# EAGLE design E-P-204-R3 (EAGLE 7.7.0)
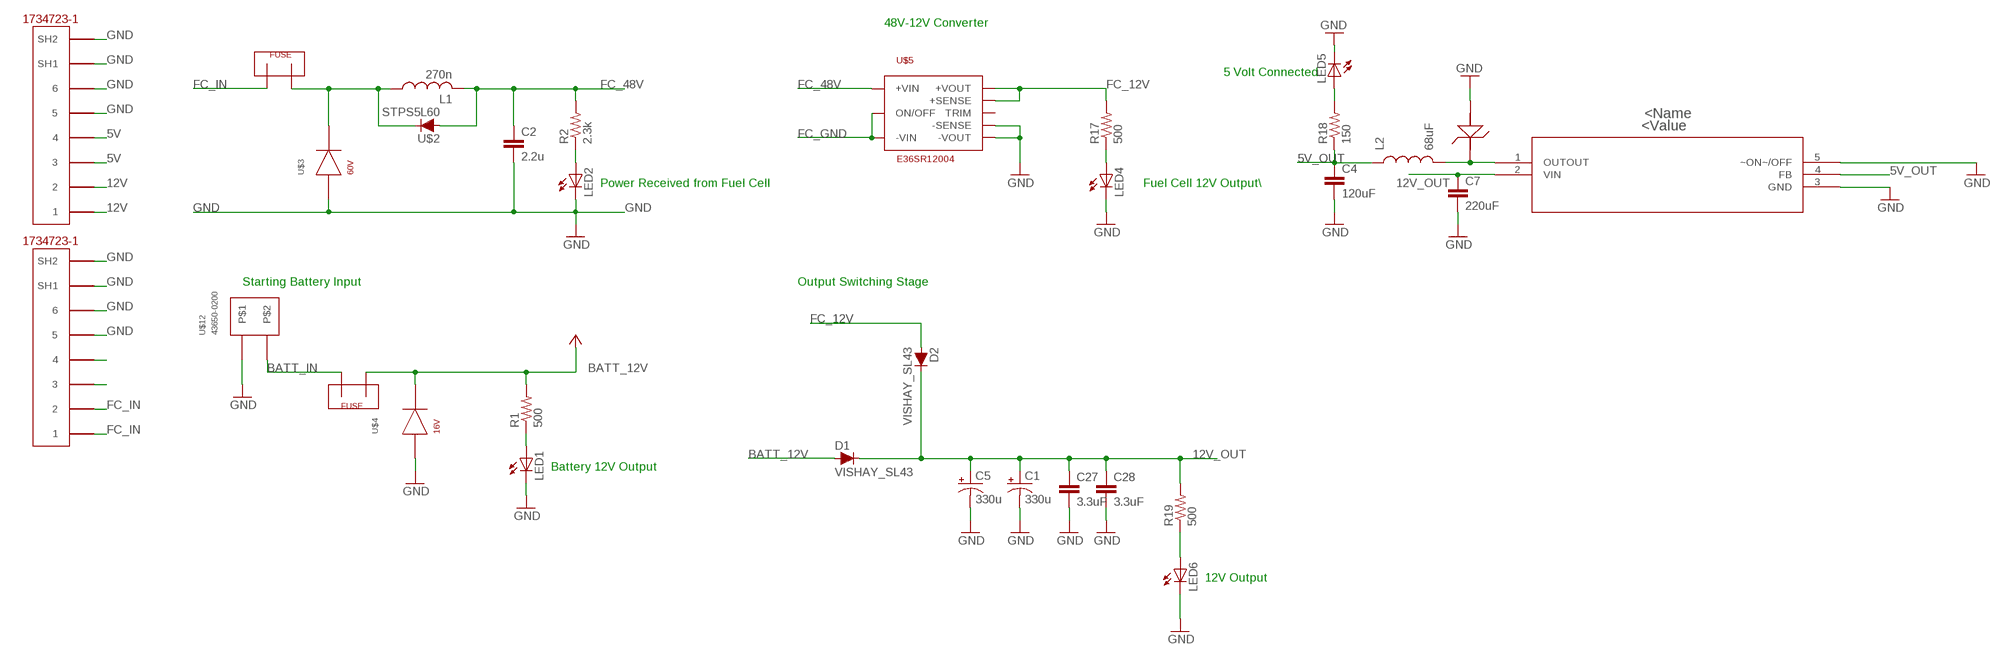
[diagram p0: schematic, sheet 1]

## Parts
C1  330u  CAP_POLE  [PANASONIC_E]
C2  2.2u  C-EUC1210  [C1210]
C4  120uF  CAP0805  [0805]
C5  330u  CAP_POLE  [PANASONIC_E]
C7  220uF  CAP0805  [0805]
C27  3.3uF  C-EUC0805K  [C0805K]
C28  3.3uF  C-EUC0805K  [C0805K]
D1  VISHAY_SL43  [DO-214AB_SMC]
D2  VISHAY_SL43  [DO-214AB_SMC]
L1  270n  L-USL3225P  [L3225P]
L2  68uF  INDUCTOR0805  [0805]
LED1  LED1206  [LED-1206]
LED2  LED1206  [LED-1206]
LED4  LED1206  [LED-1206]
LED5  LED1206  [LED-1206]
LED6  LED1206  [LED-1206]
R1  500  R-US_M0805  [M0805]
R2  2.3k  R-US_M0805  [M0805]
R17  500  R-US_M0805  [M0805]
R18  150  R-US_M0805  [M0805]
R19  500  R-US_M0805  [M0805]
U$2  STPS5L60  [STM_SMC]
U$3  SMBJ60CA  [.277X.089]
U$4  SMAJ16CA  [.25X.07]
U$5  E36SR12004  [2.30X0.90X0.34]
U$6  5555140-6  [1734723-1_RJ11]
U$7  FUSEMINI-BLADE  [MINI-BLADE-FUSE]
U$8  LM2595T-5.0  [T05D]
U$9  MURS120T3G  [MURS120T3G]
U$10  FUSEMINI-BLADE  [MINI-BLADE-FUSE]
U$11  5555140-6  [1734723-1_RJ11]
U$12  43650-0200  [43650-0200]

## Nets
5V: U$11.3 U$11.4
5V_OUT: C4.1 L2.1 R18.1 U$8.4(FB)
12V: U$11.1 U$11.2
12V_OUT: C1.+ C5.+ C7.1 C27.1 C28.1 D1.C D2.C R19.2 U$8.2(VIN)
BATT_12V: D1.A R1.2 U$4.CATHODE U$10.OUT ; supply symbol labelled +5V
BATT_IN: U$10.IN U$12.P$1
FC_12V: D2.A R17.2 U$5.P$7(+SENSE) U$5.P$8(+VOUT)
FC_48V: C2.1 L1.2 R2.2 U$2.A U$5.P$1(+VIN)
FC_FUSED: L1.1 U$2.C U$3.CATHODE U$7.IN
FC_GND: U$5.P$2(ON/OFF) U$5.P$3(-VIN)
FC_IN: U$6.1 U$6.2 U$7.OUT
GND: C1.- C2.2 C4.2 C5.- C7.2 C27.2 C28.2 LED1.C LED2.C LED4.C LED5.C LED6.C U$3.ANODE U$4.ANODE U$5.P$4(-VOUT) U$5.P$5(-SENSE) U$6.5 U$6.6 U$6.SH1 U$6.SH2 U$8.3(GND) U$8.5(~ON~/OFF) U$9.P$2(PIN1) U$11.5 U$11.6 U$11.SH1 U$11.SH2 U$12.P$2
N$3: LED1.A R1.1
N$4: LED2.A R2.1
N$16: L2.2 U$8.1(OUTOUT) U$9.P$1
N$17: LED5.A R18.2
N$20: U$6.4
N$21: LED4.A R17.1
N$23: U$6.3
N$24: LED6.A R19.1
Unconnected: U$5.P$6(TRIM)

## Notes on the sheet
- 48V-12V Converter
- 5 Volt Connected
- Power Received from Fuel Cell | Fuel Cell 12V Output\
- Starting Battery Input | Output Switching Stage
- Battery 12V Output
- 12V Output

## Library data of the parts
C1 C5 = SparkFun-Capacitors:CAP_POL: Capacitor Polarized These are standard SMD and PTH capacitors. Normally 10uF, 47uF, and 100uF in electrolytic and tantalum varieties. Always verify the external diameter of the through hole cap, it varies with capacity, voltage, and manufacturer. The EIA devices should be standard.
C2 C27 C28 = resistor:C-EU: CAPACITOR, European symbol
C4 C7 = SparkFun-Passives:CAP: Capacitor Standard 0603 ceramic capacitor, and 0.1" leaded capacitor.
D1 D2 = Power Board Components:VISHAY_SL43
L1 = resistor:L-US: INDUCTOR, American symbol
L2 = SparkFun-Passives:INDUCTOR: Inductors Basic Inductor/Choke - 0603 and 1206. Footprints are not proven and vary greatly between part numbers. INDUCTOR POWER 3.3UH 4.0A SMD 0.197" L x 0.197" W x 0.177" H (5.00mm x 5.00mm x 4.50mm)
LED1 LED2 LED4-LED6 = SparkFun:LED: LEDs Standard schematic elements and footprints for 5mm, 3mm, 1206, and 0603 sized LEDs. 5mm - Spark Fun Electronics SKU : COM-00529 (and others)
R1 R2 R17-R19 = rcl:R-US_: RESISTOR, American symbol
U$2 = Power Board Components:STPS5L60
U$3 = Power Board Components:SMBJ60CA
U$4 = Power Board Components:SMAJ16CA
U$5 = Power Board Components:E36SR12004
U$6 U$11 = 5555140-6 RJ11:5555140-6
U$7 U$10 = Shell2013:FUSE
U$8 = 5V Reg LM2595T-5.0:LM2595T-5.0; BASE_PN: LM259X; COMPTYPE: Switcher; COPYRIGHT: Copyright C 2015 Accelerated Designs. All rights reserved; MANUFACTURER_PART_NUMBER: LM2595T50; SYMBOL: NameLM2595T50; TYPE: LM2595T5.0; VENDOR: National Semiconductor; VERSION: 05022007
U$9 = MURS120T3G:MURS120T3G
U$12 = Shell2013:43650-0200

## Board
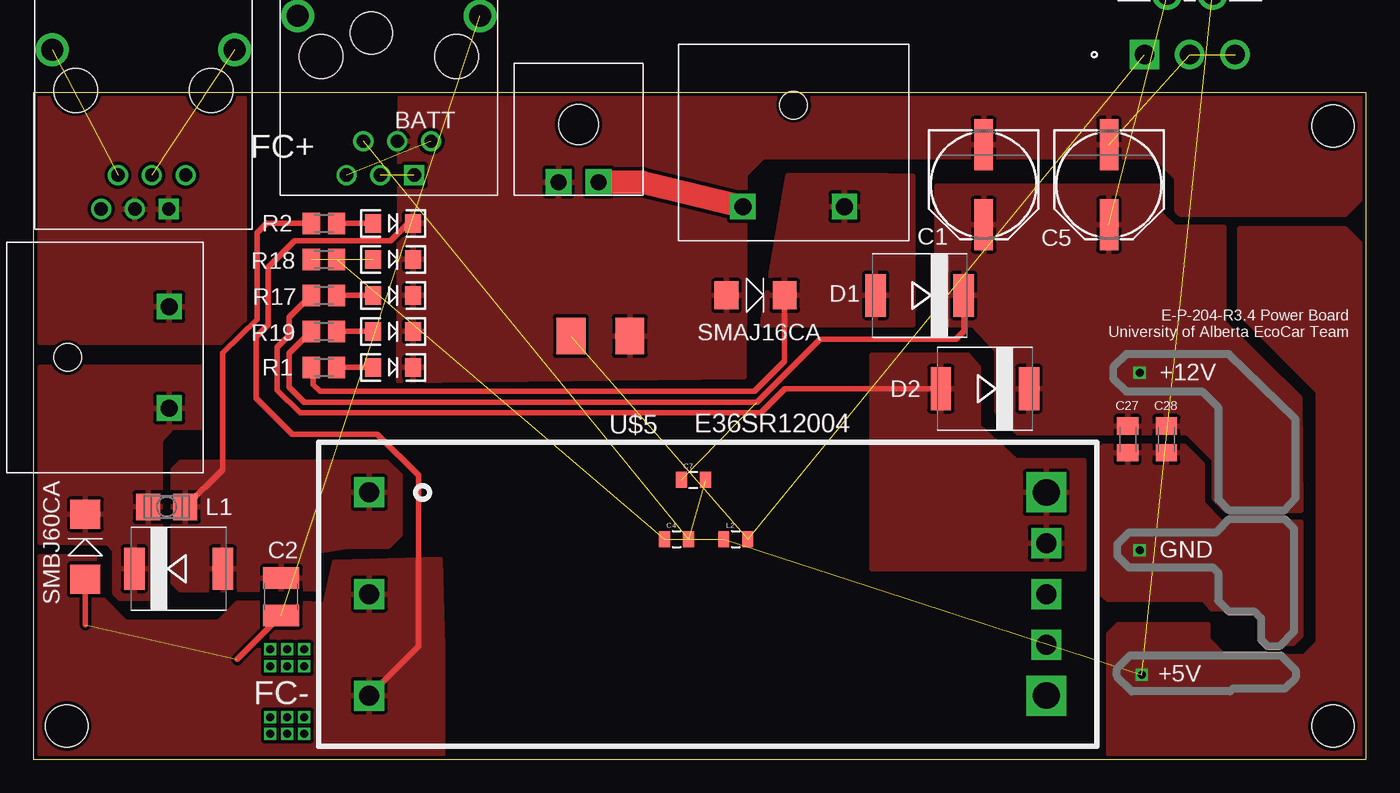
[diagram p1: board, top side]
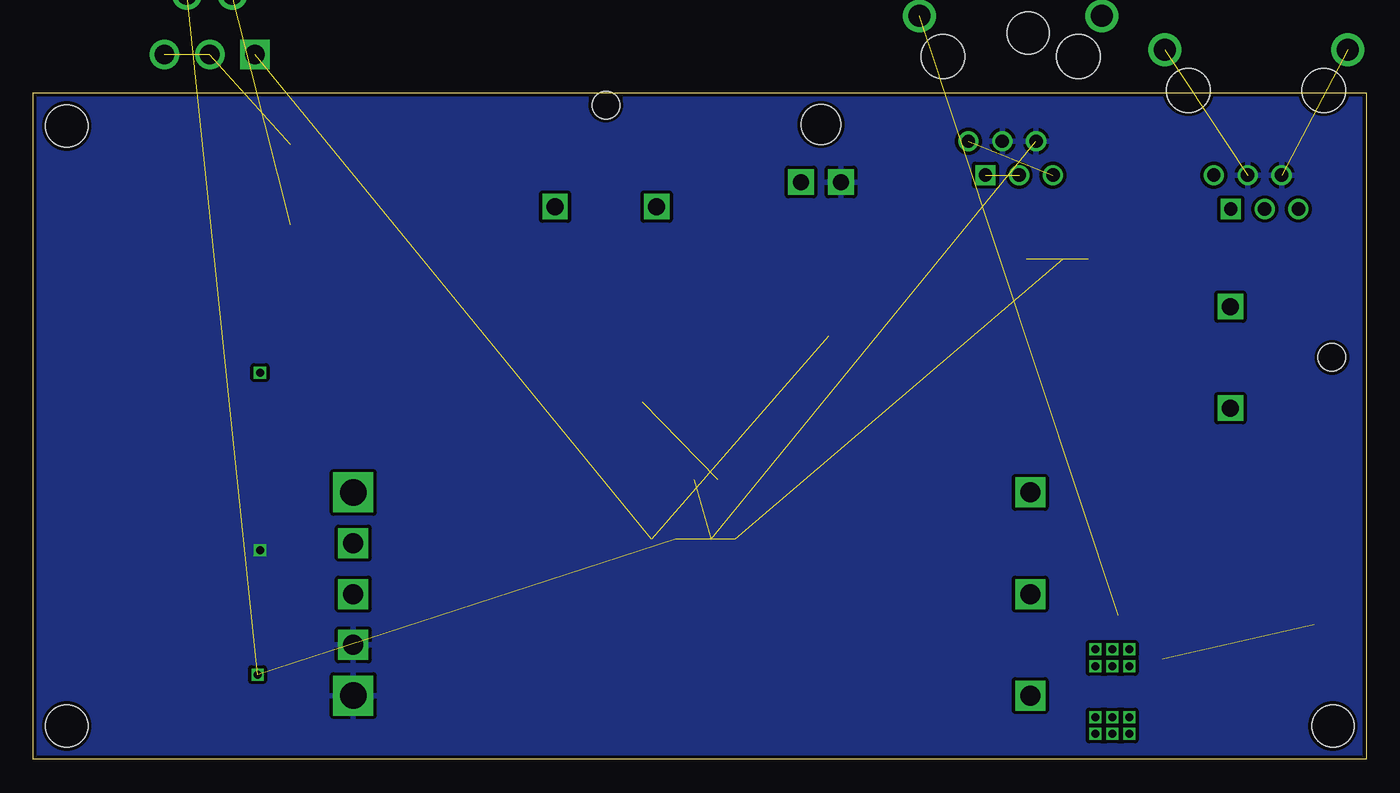
[diagram p2: board, bottom side, seen from below]

Size 100 x 50 mm. Coordinates in mm from the lower left corner, seen from the top.
Outline: 0,0 100,0 100,50 0,50 0,0
Copper layers (1*16): Top 0.035mm / dielectric 1.5mm / Bottom 0.035mm
Design rules "SeeedStudio_2layer_DRU_no_angle_20140221 *": minimum track width 10mil, minimum drill 12mil, track to track 10mil, track to pad 10mil, pad to pad 10mil, via to via 10mil, smd to smd 0mil, copper to edge 10mil, drill to drill 10mil, minimum pad ring 10mil, minimum via ring 6mil, stop-mask expansion 2mil, vias tented up to drill 100mil, thermal gap 10mil
Holes 3.17 mm at 97.5,47.5 2.5,2.5 97.5,2.5 25.36,54.48

### Footprints (pad centres in the part's own frame; a part is rotated, then mirrored left to right if it is on the bottom)
PANASONIC_E = smd 3.8 x 1.4: + 3,0; - -3,0
C1210 = smd 1.6 x 2.7: 1 -1.4,0; 2 1.4,0
0805 = smd 0.8 x 1.2: 1 -0.9,0; 2 0.9,0
C0805K = smd 1.3 x 1.6: 1 -1,0; 2 1,0
DO-214AB_SMC = smd 1.524 x 3.2: A 3.302,0; C -3.302,0
L3225P = smd 1.8 x 2: 1 -1.4,0; 2 1.4,0
LED-1206 = smd 1.2 x 1.4: A -1.5,0; C 1.5,0
M0805 = smd 1.3 x 1.6: 1 -0.95,0; 2 0.95,0
STM_SMC = smd 1.54 x 3.14: A 3.325,0; C -3.325,0
.277X.089 = smd 2.159 x 2.261: ANODE 0,0; CATHODE 4.877,0
.25X.07 = smd 1.778 x 2.083: ANODE 0,0; CATHODE 4.369,0
2.30X0.90X0.34 = drill 1.5 square: P$1 -25.4,7.62; P$2 -25.4,0; P$3 -25.4,-7.62; P$5 25.4,-3.81; P$6 25.4,0; P$7 25.4,3.81 | drill 2 square: P$4 25.4,-7.62; P$8 25.4,7.62
1734723-1_RJ11 = drill 1 square: 1 -2.54,2.54 | drill 1: 2 0,2.54; 3 2.54,2.54; 4 -3.81,0; 5 -1.27,0; 6 1.27,0 | drill 1.65: SH1 -7.5,-9.4; SH2 6.22,-9.4 | hole 3.3: -5.72,-6.35; 4.44,-6.35
MINI-BLADE-FUSE = drill 1.27 square: IN 3.81,7.62; OUT -3.81,7.62 | hole 2.083: 0,0
T05D = drill 1.473 pad 1.981 square: 1 -6.807,-13.183 | drill 1.473 pad 1.981: 2 -5.105,-8.712; 3 -3.404,-13.183; 4 -1.702,-8.712; 5 0,-13.183
MURS120T3G = smd 2.159 x 2.743: P$1 -2.21,0; P$2 2.21,0
43650-0200 = drill 1.2 pad 1.93 square: P$1 -1.5,0; P$2 1.5,0 | hole 3: 0,-4.32

### Placement (x,y rotation side)
C1  71.3,43.1 270 top
C2  18.6,12.2 270 top
C4  48.26,16.51 0 top
C5  80.7,43.1 270 top
C7  49.53,20.95 0 top
C27  82.1,24 270 top
C28  85,24 270 top
D1  66.5,34.8 180 top
D2  71.4,27.8 180 top
L1  10,18.93 0 top
L2  52.7,16.51 0 top
LED1  27,29.4 0 top
LED2  27,40.2 0 top
LED4  27,34.8 0 top
LED5  27,37.5 0 top
LED6  27,32.1 0 top
R1  21.8,29.4 180 top
R2  21.8,40.2 180 top
R17  21.8,34.8 180 top
R18  21.8,37.5 180 top
R19  21.8,32.1 180 top
U$2  10.9,14.3 0 top
U$3  3.9,13.5 90 top
U$4  52,34.8 0 top
U$5  50.6,12.4 0 top
U$6  7.62,43.81 180 top
U$7  2.57,30.15 270 top
U$8  90.17,66.04 0 top
U$9  42.55,31.75 0 top
U$10  57.05,49.07 180 top
U$11  26.04,46.35 180 top
U$12  40.91,43.3 180 top

### Tracks (layer width: path | path; a pad name or v marks a point on that pad's centre or on a via)
5V  (1 unrouted)
5V_OUT  (via drill 0.6)  (4 unrouted)
  other vias: 83.19,6.35
  pour Top: 90.5,39.8 90.5,33.5 96.4,27.6 96.4,8.7 95.4,7.7 89.4,7.7 88.1,9 88.1,10.1 81.4,10.1 80.7,9.4 80.7,0.4 99.6,0.4 99.6,38.6 98.4,39.8
12V  (1 unrouted)
12V_OUT  (via drill 0.6)  (2 unrouted)
  Top 0.406: D1.C 69.8,32.1 69.2,31.5 59,31.5 54.3,26.8 20.3,26.8 19.2,27.9 19.2,30.45 R19.2
  other vias: 83,29
  pour Top: 67.8,32.6 70.5,32.6 72.3,30.7 72.3,26.1 73.9,24.5 86.6,24.5 88.6,22.5 88.6,19.6 89.5,18.7 95.1,18.7 95,27.1 89.3,32.7 89.3,39.9 85.6,39.9 84.6,40.9 84.6,43 67.8,43
BATT_12V
  Top 0.406: U$4.CATHODE 56.37,29.87 54.1,27.6 21.5,27.6 21,28.1 21,29.25 R1.2
  pour Top: 56.6,43.77 54.7,32.6 66,32.6 66,43.74 64.07,43.77
BATT_IN
  Top 1.778: U$12.P$1 45.67,43.3 U$10.IN
FC_12V
  Top 0.406: D2.A 56.4,27.8 54.6,26 20,26 18.3,27.7 18.3,30.9 19.2,31.8 19.2,33.15 R17.2
  pour Top: 78.8,14.3 62.9,14.3 62.9,30.3 70.1,30.3 70.9,29.4 70.9,25 73.7,22.4 78.8,22.4
FC_48V
  Top 0.406: R2.2 17.5,40.2 16.8,39.5 16.8,33 14.2,30.5 14.2,21.73 L1.2
  pour Top: 10.5,21.7 10.5,13.3 11.1,12.7 21.3,12.8 21.3,15.6 23.6,16 26.6,16 27.5,16.9 27.5,21.3 26.5,22.3 11.1,22.3
FC_FUSED
  pour Top: 12.6,29.4 0.5,29.4 0.5,16.3 5.6,16.2 6.1,15.7 6.1,12.5 6.5,12.1 9.1,12.1 9.5,12.5 9.5,23.9 10.4,24.9 12.6,24.9
FC_GND
  Top 0.406: 28.1,40.2 26.8,38.9 19.6,38.9 17.6,36.9 17.6,32.6 16.7,31.7 16.7,27.1 19.4,24.4 25.8,24.4 28.9,21.3 28.9,8.48 U$5.P$3
  pour Top: 0.5,15.2 4.5,15.2 5.2,14.4 5.2,12 6.9,10.3 13.9,10.3 15.3,11.7 20.4,11.7 21.9,11.6 22.6,14.8 30.5,15 30.7,8.4 30.7,0.4 0.5,0.4
FC_IN
  pour Top: 0.5,49.6 15.8,49.6 15.8,31.3 0.5,31.3
GND  (via drill 0.6)  (8 unrouted)
  Top 0.406: U$3.ANODE 3.9,10.1 | 15.3,7.5 C2.2
  other vias: 83,15.7
  pour Bottom (rank 2): 99.6,0.4 99.6,49.6 0.5,49.6 0.5,0.4
  pour Top: 53.3,28.7 53.4,43.9 54.7,45.2 84.2,45.2 85.8,43.6 85.8,41.2 86.1,40.9 98.4,40.9 99.6,42.1 99.6,49.6 27.5,49.6 27.4,28.4
  pour Top: 95.1,17.8 89.1,17.8 87.7,19.2 87.7,22.1 86.3,23.5 80.3,23.5 79.9,23.1 79.9,12.6 80.6,12 87.8,12 88.4,11.3 91.3,11.3 92,10.6 92.1,9.2 92.5,8.7 94.5,8.7 95.1,9.3
N$1  (via drill 0.6)
  other vias: 17.78,1.91
N$2  (via drill 0.6)
  other vias: 17.78,3.17
N$3
  Top 0.406: R1.1 LED1.A
N$4
  Top 0.406: R2.1 LED2.A
N$5  (via drill 0.6)
  other vias: 19.05,3.17
N$6  (via drill 0.6)
  other vias: 19.05,1.91
N$7  (via drill 0.6)
  other vias: 20.32,1.91
N$8  (via drill 0.6)
  other vias: 20.32,3.17
N$9  (via drill 0.6)
  other vias: 17.78,6.99
N$10  (via drill 0.6)
  other vias: 19.05,6.99
N$12  (via drill 0.6)
  other vias: 20.32,6.99
N$13  (via drill 0.6)
  other vias: 20.32,8.26
N$14  (via drill 0.6)
  other vias: 19.05,8.26
N$15  (via drill 0.6)
  other vias: 17.78,8.26
N$16  (2 unrouted)
N$17  (1 unrouted)
N$21
  Top 0.406: R17.1 LED4.A
N$24
  Top 0.406: R19.1 LED6.A

### Text on the board
tPlace: BATT | FC+ | E-P-204-R3.4 Power Board / University of Alberta EcoCar Team | +12V | GND | FC- | +5V
tDocu: FC_48V | 5V_OUT | FC_12V | 12V_OUT | BATT_12V